# Altium schematic sheet Arduino.SchDoc
size A4
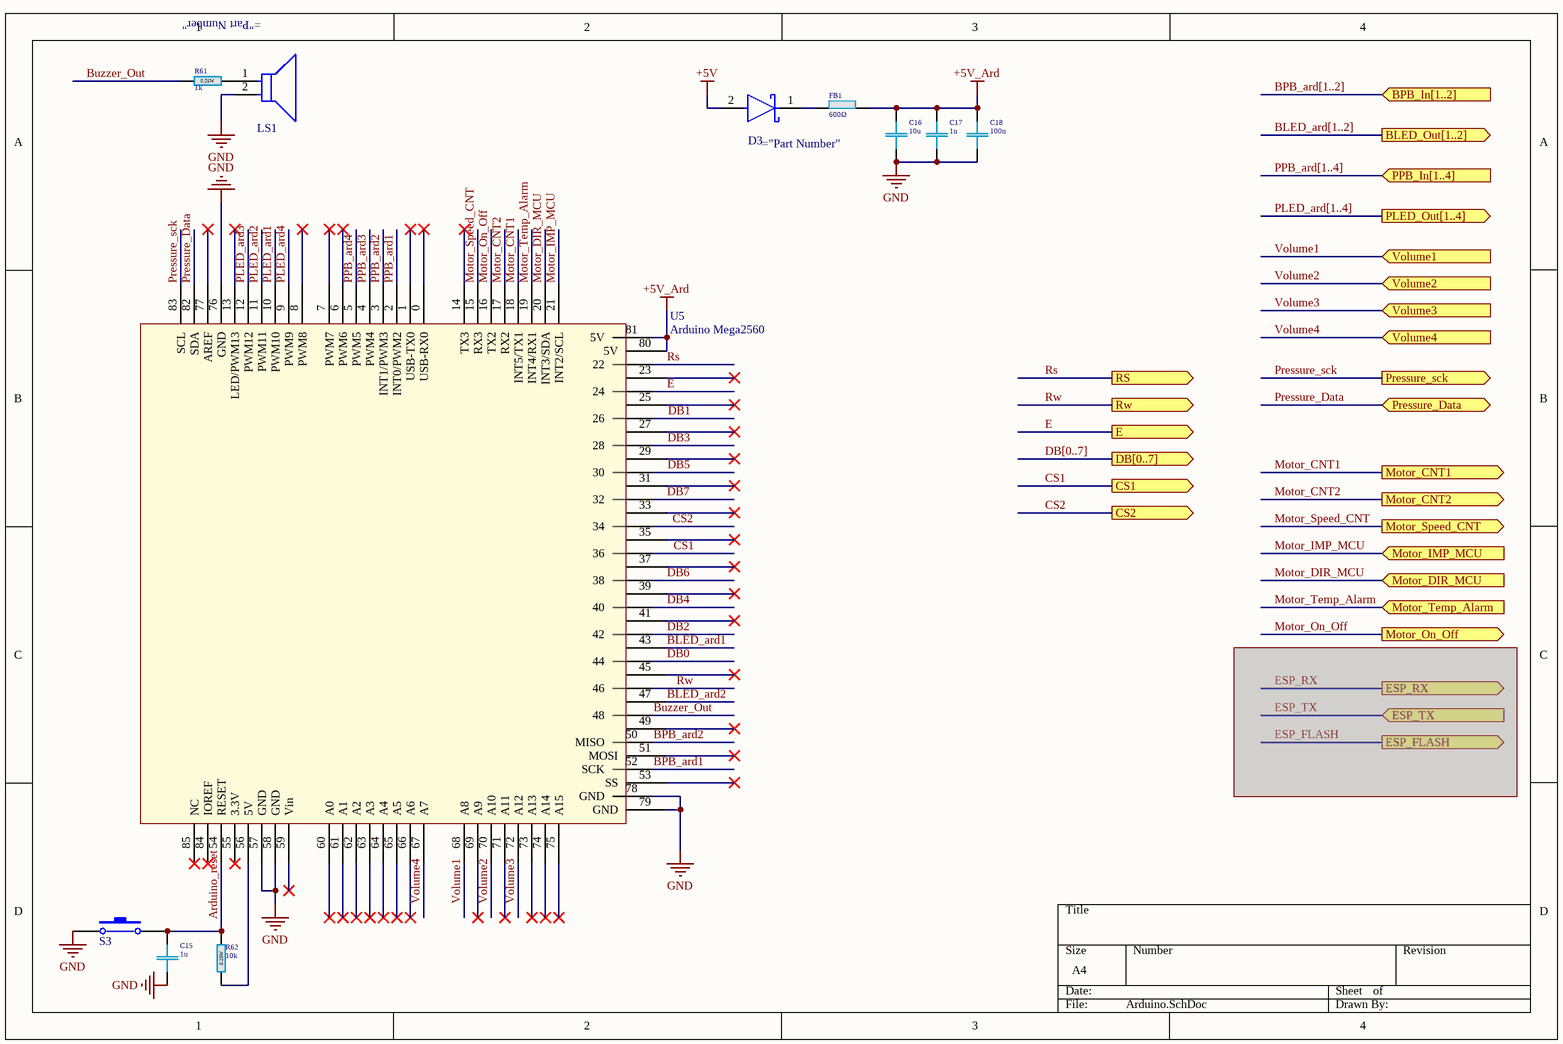
[diagram p0: Arduino.SchDoc]

## Parts
C15  1u  [C1206]
C16  10u  [C1206]
C17  1u  [C1206]
C18  100n  [C1206]
D3  SS34  [DIOM5026X262N]  (value not drawn)
FB1  ZTyp@100MHz: 600Ω  [L1206]  (hidden comment: 0.955u)
LS1  KXG1205C  [BUZZER]  (value not drawn)
R61  1k  [R1206]
R62  10k  [R1206]
S3  PB-2pin  [PB-2pin]  (value not drawn)
U5  Arduino Mega2560  [MEGA2560]

## Ports
BLED_Out[1..2] (out), BPB_In[1..2] (in), CS1 (out), CS2 (out), DB[0..7] (out), E (out), ESP_FLASH (out), ESP_RX (out), ESP_TX (in), Motor_CNT1 (out), Motor_CNT2 (out), Motor_DIR_MCU (in), Motor_IMP_MCU (in), Motor_On_Off (out), Motor_Speed_CNT (out), Motor_Temp_Alarm (in), PLED_Out[1..4] (out), PPB_In[1..4] (in), Pressure_Data (bidir), Pressure_sck (out), RS (out), Rw (out), Volume1 (in), Volume2 (in), Volume3 (in), Volume4 (in)

## Nets
+5V: D3.2(A)
+5V_Ard: C16.1 C17.1 C18.1 FB1.2 U5.80(5V) U5.81(5V)
GND: C15.2 C16.2 C17.2 C18.2 LS1.2(C) S3.1 U5.57(GND) U5.58(GND) U5.76(GND) U5.78(GND) U5.79(GND)
Arduino_reset: C15.1 R62.2 S3.2 U5.54(RESET)
BLED_ard1: U5.43
BLED_ard2: U5.47
BPB_ard1: U5.52(SCK)
BPB_ard2: U5.50(MISO)
Buzzer_Out: R61.1 U5.48
CS1: U5.36 ; port CS1
CS2: U5.34 ; port CS2
DB0: U5.44
DB1: U5.26
DB2: U5.42
DB3: U5.28
DB4: U5.40
DB5: U5.30
DB6: U5.38
DB7: U5.32
E: U5.24 ; port E
Motor_CNT1: U5.18(INT5/TX1) ; port Motor_CNT1
Motor_CNT2: U5.17(RX2) ; port Motor_CNT2
Motor_DIR_MCU: U5.20(INT3/SDA) ; port Motor_DIR_MCU
Motor_IMP_MCU: U5.21(INT2/SCL) ; port Motor_IMP_MCU
Motor_On_Off: U5.16(TX2) ; port Motor_On_Off
Motor_Speed_CNT: U5.15(RX3) ; port Motor_Speed_CNT
Motor_Temp_Alarm: U5.19(INT4/RX1) ; port Motor_Temp_Alarm
PLED_ard1: U5.10(PWM10)
PLED_ard2: U5.11(PWM11)
PLED_ard3: U5.12(PWM12)
PLED_ard4: U5.9(PWM9)
PPB_ard1: U5.2(INT0/PWM2)
PPB_ard2: U5.3(INT1/PWM3)
PPB_ard3: U5.4(PWM4)
PPB_ard4: U5.5(PWM5)
Pressure_Data: U5.82(SDA) ; port Pressure_Data
Pressure_sck: U5.83(SCL) ; port Pressure_sck
Rs: U5.22 ; port RS
Rw: U5.46 ; port Rw
Volume1: U5.68(A8) ; port Volume1
Volume2: U5.70(A10) ; port Volume2
Volume3: U5.72(A12) ; port Volume3
Volume4: U5.67(A7) ; port Volume4
NetD3_1: D3.1(C) FB1.1
NetLS1_1: LS1.1(A) R61.2
NetR62_1: R62.1 U5.56(5V)

Not connected (* = marked no-connect by the designer): U5 0(USB-RX0)* 1(USB-TX0)* 6(PWM6)* 7(PWM7)* 8(PWM8)* 13(LED/PWM13)* 14(TX3)* 23* 25* 27* 29* 31* 33* 35* 37* 39* 41* 45* 49* 51(MOSI)* 53(SS)* 55(3.3V)* 59(Vin)* 60(A0)* 61(A1)* 62(A2)* 63(A3)* 64(A4)* 65(A5)* 66(A6)* 69(A9)* 71(A11)* 73(A13)* 74(A14)* 75(A15)* 77(AREF)* 84(IOREF)* 85(NC)*

## Buses and harness runs
bus BLED_ard[1..2] = port BLED_Out[1..2]
bus BPB_ard[1..2] = port BPB_In[1..2]
bus DB[0..7] = port DB[0..7]
bus PLED_ard[1..4] = port PLED_Out[1..4]
bus PPB_ard[1..4] = port PPB_In[1..4]

## Library data of the parts
C15-C18 = C 1206  100V X7R - 100n: SMD 1206   100V X7R 10%; Part Number: CL31B104KCFNNNE; Manufacturer: Samsung; TYPE: Capacitors; Package-mm: 3216; Mount Type: SMT; Publisher: Hefest; Manufacturer Alternate: *; Part Number Alternate: *; Published: 07.04.2019; Supplier 1: Comet; Supplier Part Number 1: C1206 100nF 100V X7R SAMSUNG; RoHS: Y; Technology: Ceramic  MLCC; Package: 1206; VDC: 100V; TempCo: X7R; Tolerance %: ±10%; VAC: *; ESR Ohm: *; ComponentLink1Description: Datasheet Link; ComponentLink1URL: https://store.comet.bg/download-file.php?id=11; Temperature Range: -55°C ~ +125°C; Price: 0.090; ComponentLink2Description: Characteristics data; ComponentLink2URL: https://store.comet.bg/download-file.php?id=3821
  C15 C17: Value: 1u
  C16: Value: 10u
  C18: Value: 100n
FB1 = FB BLM31P 600: SMD 1206 1.5A 600Ω/80mΩ; Part Number: BLM31PG601SN1L; Manufacturer: Murata; TYPE: Ferrite Bead; Ind: 0.955uH; DC Resistance: 80mΩ; Material: Ferrite; Package-mm: 3216; Tolerance %: ±25%; Temperature Range: -55°C ~ +125°C; Imax: 1.5A; Irms: *; Isat: *; Technology: Chip; Published: 07.04.2019; Publisher: Hefest; Mount Type: SMT; Package: 1206; ComponentLink1Description: Datasheet Link; ComponentLink1URL: https://store.comet.bg/download-file.php?id=5324; RoHS: Y; Ztyp@1GHz: *; Manufacturer Alternate: *; Supplier 1: Comet; Supplier Part Number 1: BLM31PG601SN1L; Part Number Alternate: *; Price: 0.161; Value: 0.955u
R61 R62 = R 1206-5%: SMD 1206 0.25W   5% 200V; Manufacturer: YAGEO; TempCo: ±100ppm/°C; Package-mm: 3216; Value Code: 102; Part Number: *; Mount Type: SMT; Publisher: Hefest; Manufacturer Alternate: *; Published: 07.04.2019; Supplier 1: Comet; Supplier Part Number 1: R1206 1.0K 5% YAG/ASJ; RoHS: Y; Technology: Thick film; Package: 1206; VDC: 200V; Tolerance %: ±5%; ComponentLink1Description: Datasheet Link; ComponentLink1URL: https://store.comet.bg/download-file.php?id=140; Temperature Range: -55°C ~ +155°C; Price: 0.054; Part Number Alternate: *; TYPE: Resistor; Power: 0.25W
  R61: Value: 1k
  R62: Value: 10k
S3 = PB-2pin: Switch; E-mail: picpars@gmail.com; Designer: Seyed Mohsen Ghasemian; Publisher: www.picpars.com; WEB: www.picpars.com
U5 = Mega_2560: Arduino Mege 2560 R3